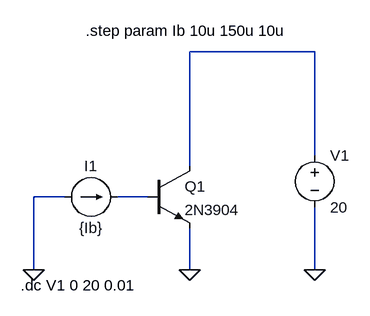
[diagram p0: schematic transistor_Ic_Vce_curves.asc]
transistor_Ic_Vce_curves.asc, the LTspice schematic file:
Version 4
SHEET 1 880 680
WIRE 384 -32 192 -32
WIRE 384 128 384 -32
WIRE 192 144 192 -32
WIRE 0 192 -48 192
WIRE 128 192 80 192
WIRE -48 304 -48 192
WIRE 192 304 192 240
WIRE 384 304 384 208
FLAG -48 304 0
FLAG 192 304 0
FLAG 384 304 0
SYMBOL npn 128 144 R0
SYMATTR InstName Q1
SYMATTR Value 2N3904
SYMBOL current 0 192 R270
WINDOW 0 32 40 VTop 2
WINDOW 3 -32 40 VBottom 2
WINDOW 123 0 0 Left 0
WINDOW 39 0 0 Left 0
SYMATTR InstName I1
SYMATTR Value {Ib}
SYMBOL voltage 384 112 R0
WINDOW 123 0 0 Left 0
WINDOW 39 0 0 Left 0
SYMATTR InstName V1
SYMATTR Value 20
TEXT 32 -64 Left 2 !.step param Ib 10u 150u 10u
TEXT -68 328 Left 2 !.dc V1 0 20 0.01

The netlist it stands for:
* transistor_Ic_Vce_curves.asc
Q1 N001 N002 0 0 2N3904
I1 0 N002 {Ib}
V1 N001 0 20
.model NPN NPN
.model PNP PNP
.lib standard.bjt
.step param Ib 10u 150u 10u
.dc V1 0 20 0.01
.backanno
.end